# Altium schematic sheet 02 Sensors.SchDoc
size A3; CheckedBy: TBD; Engineer: Lukas Henkel; Revision: 0.2; SheetNumber: 3; SheetTotal: 3
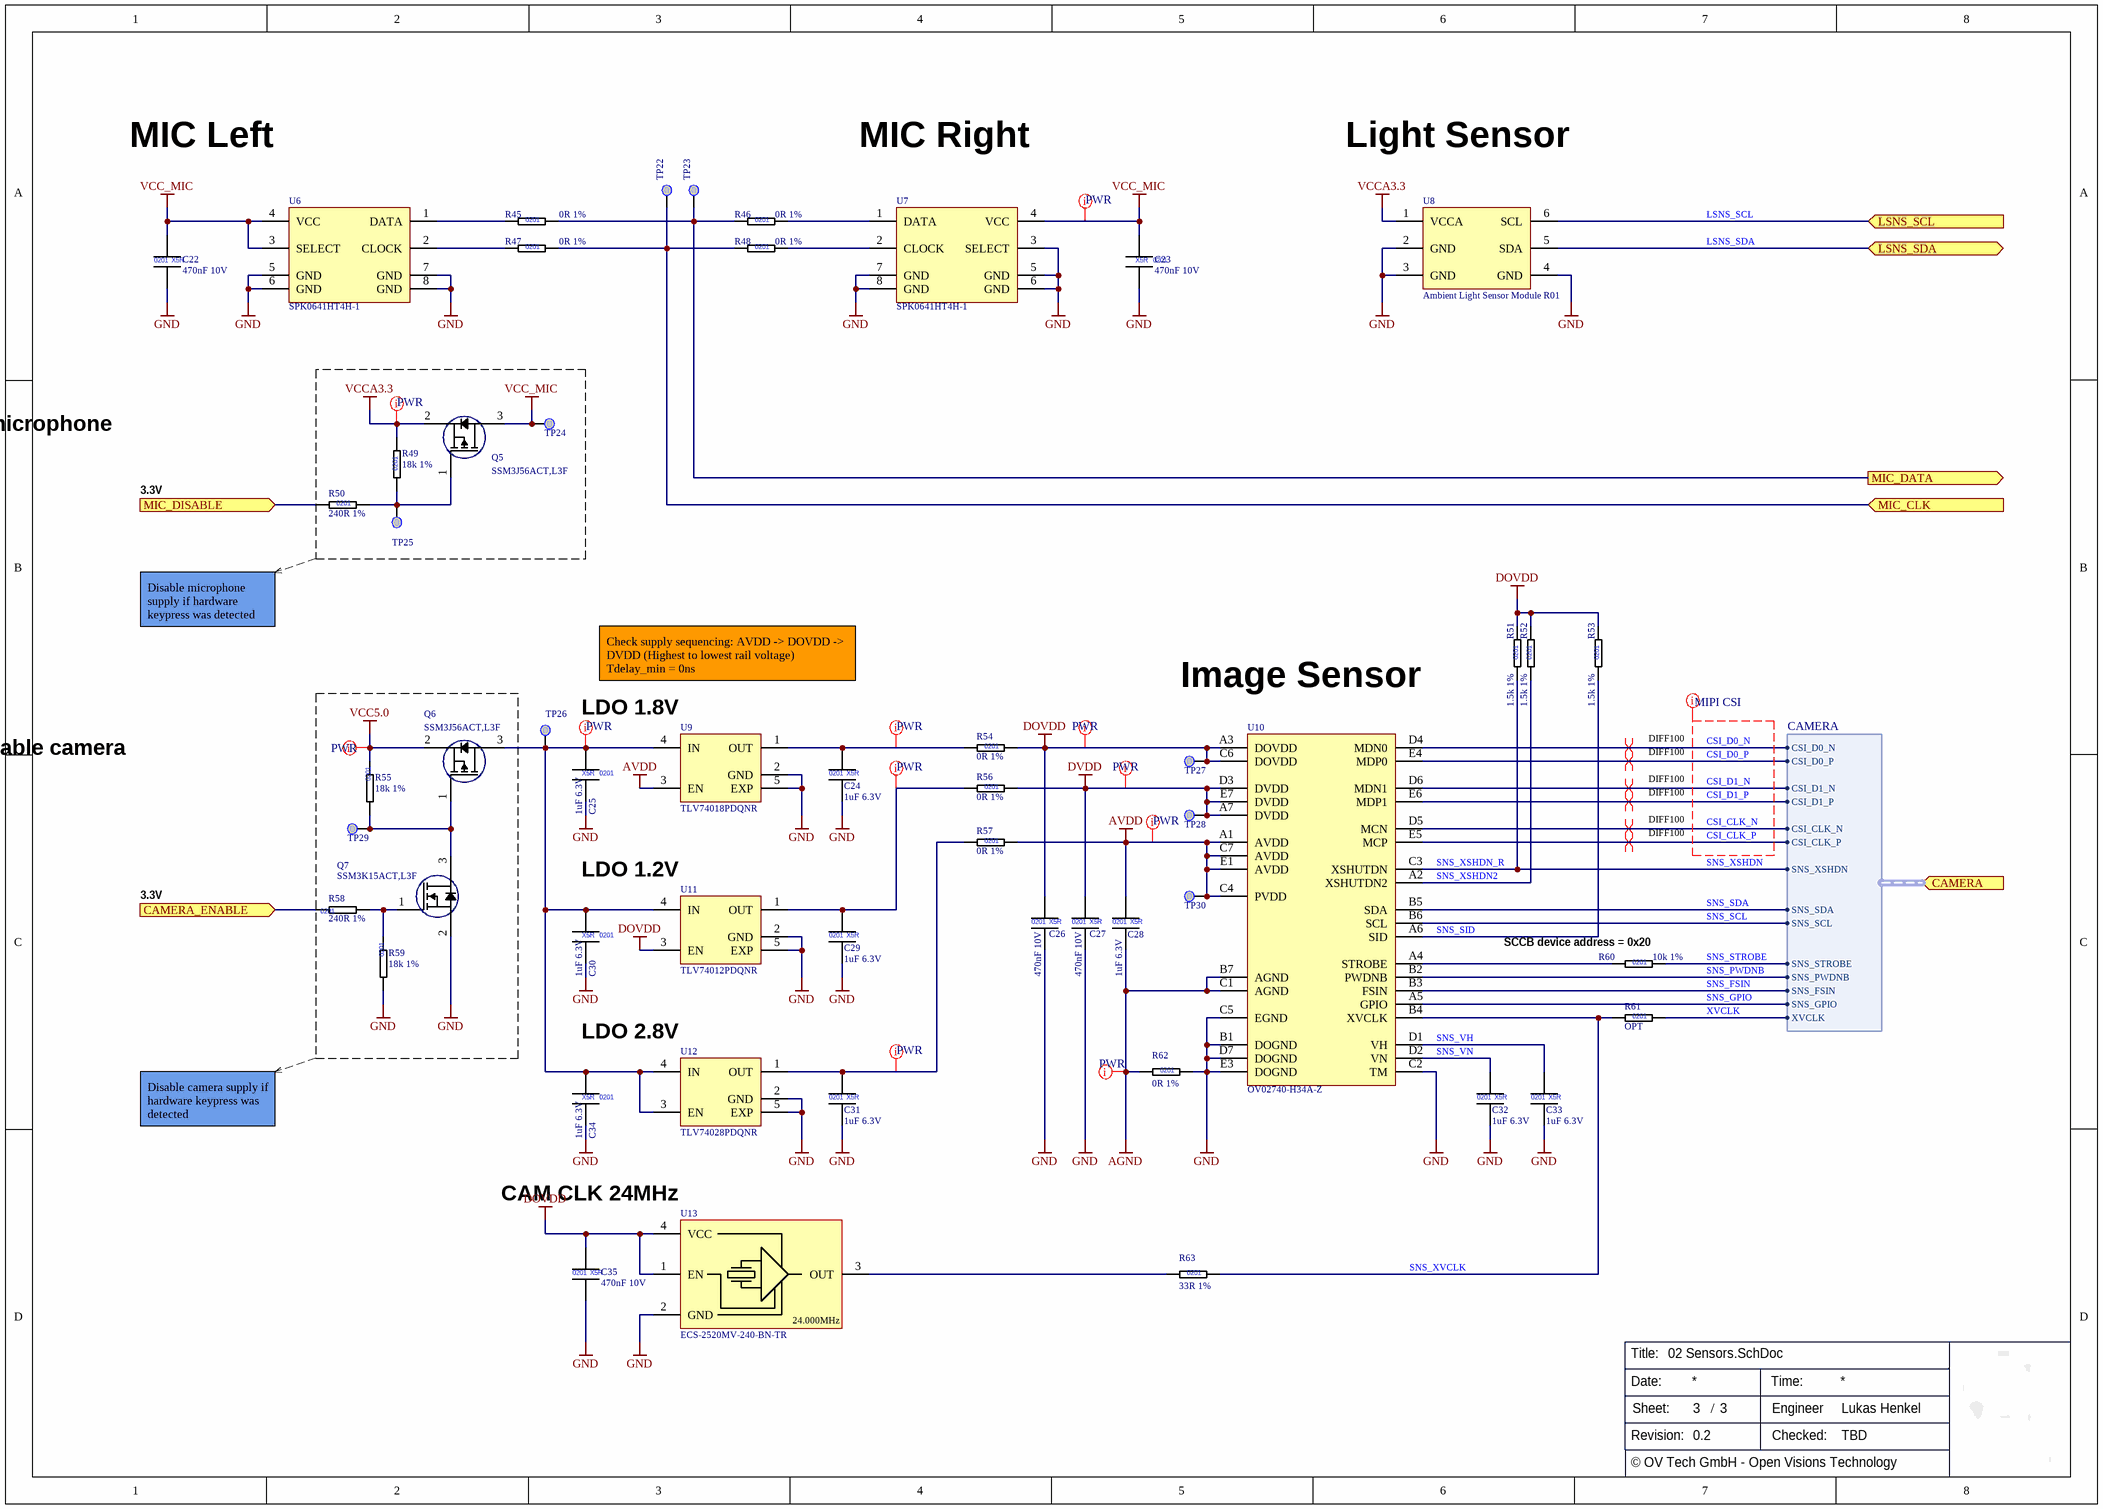
[diagram p0: 02 Sensors.SchDoc]

## Parts
C22  470nF 10V  [CAPC0603X03L]
C23  470nF 10V  [CAPC0603X03L]
C24  1uF 6.3V  [CAPC0603X03L]
C25  1uF 6.3V  [CAPC0603X03L]
C26  470nF 10V  [CAPC0603X03L]
C27  470nF 10V  [CAPC0603X03L]
C28  1uF 6.3V  [CAPC0603X03L]
C29  1uF 6.3V  [CAPC0603X03L]
C30  1uF 6.3V  [CAPC0603X03L]
C31  1uF 6.3V  [CAPC0603X03L]
C32  1uF 6.3V  [CAPC0603X03L]
C33  1uF 6.3V  [CAPC0603X03L]
C34  1uF 6.3V  [CAPC0603X03L]
C35  470nF 10V  [CAPC0603X03L]
Q5  SSM3J56ACT,L3F  [DFN65P100X50-3L]
Q6  SSM3J56ACT,L3F  [DFN65P100X50-3L]
Q7  SSM3K15ACT,L3F  [DFN65P100X50-3L]
R45  0R 1%  [RESC0603X03L]
R46  0R 1%  [RESC0603X03L]
R47  0R 1%  [RESC0603X03L]
R48  0R 1%  [RESC0603X03L]
R49  18k 1%  [RESC0603X03L]
R50  240R 1%  [RESC0603X03L]
R51  1.5k 1%  [RESC0603X03L]
R52  1.5k 1%  [RESC0603X03L]
R53  1.5k 1%  [RESC0603X03L]
R54  0R 1%  [RESC0603X03L]
R55  18k 1%  [RESC0603X03L]
R56  0R 1%  [RESC0603X03L]
R57  0R 1%  [RESC0603X03L]
R58  240R 1%  [RESC0603X03L]
R59  18k 1%  [RESC0603X03L]
R60  10k 1%  [RESC0603X03L]
R61  OPT  [RESC0603X03L]  (no BOM)
R62  0R 1%  [RESC0603X03L]
R63  33R 1%  [RESC0603X03L]
TP22  Testpoint 0.5mm  [TP_0.50mm]  (value not drawn)  (no BOM)
TP23  Testpoint 0.5mm  [TP_0.50mm]  (value not drawn)  (no BOM)
TP24  Testpoint 0.5mm  [TP_0.50mm]  (value not drawn)  (no BOM)
TP25  Testpoint 0.5mm  [TP_0.50mm]  (value not drawn)  (no BOM)
TP26  Testpoint 0.5mm  [TP_0.50mm]  (value not drawn)  (no BOM)
TP27  Testpoint 0.5mm  [TP_0.50mm]  (value not drawn)  (no BOM)
TP28  Testpoint 0.5mm  [TP_0.50mm]  (value not drawn)  (no BOM)
TP29  Testpoint 0.5mm  [TP_0.50mm]  (value not drawn)  (no BOM)
TP30  Testpoint 0.5mm  [TP_0.50mm]  (value not drawn)  (no BOM)
U6  SPK0641HT4H-1  [MIC_SPK0641HT4H-1]
U7  SPK0641HT4H-1  [MIC_SPK0641HT4H-1]
U8  Ambient Light Sensor Module R01  [ABLS-R01-ambient light sensor module]
U9  TLV74018PDQNR  [X2SON-DFN]
U10  OV02740-H34A-Z  [BGA34C53P7X5_386X292X388]
U11  TLV74012PDQNR  [X2SON-DFN]
U12  TLV74028PDQNR  [X2SON-DFN]
U13  ECS-2520MV-240-BN-TR  [Oscillator_ECS-2520MV]

## Ports
CAMERA (in, harness CAMERA), CAMERA_ENABLE (in), LSNS_SCL (in), LSNS_SDA (bidir), MIC_CLK (in), MIC_DATA (out), MIC_DISABLE (in)

## Harnesses
CAMERA: CSI_D0_N, CSI_D0_P, CSI_D1_N, CSI_D1_P, CSI_CLK_N, CSI_CLK_P, SNS_XSHDN, SNS_SDA, SNS_SCL, SNS_STROBE, SNS_PWDNB, SNS_FSIN, SNS_GPIO, XVCLK

## Nets
AGND: C28.2 R62.1 U10.B7(AGND) U10.C1(AGND)
AVDD: C28.1 R57.2 TP30.TP U9.3(EN) U10.A1(AVDD) U10.C4(PVDD) U10.C7(AVDD) U10.E1(AVDD)
DOVDD: C26.1 C35.1 R51.2 R52.2 R53.2 R54.2 TP27.TP U10.A3(DOVDD) U10.C6(DOVDD) U11.3(EN) U13.1(EN) U13.4(VCC)
DVDD: C27.1 R56.2 TP28.TP U10.A7(DVDD) U10.D3(DVDD) U10.E7(DVDD)
GND: C22.2 C23.2 C24.2 C25.2 C26.2 C27.2 C29.2 C30.2 C31.2 C32.2 C33.2 C34.2 C35.2 Q7.2(S) R59.2 R62.2 U6.5(GND) U6.6(GND) U6.7(GND) U6.8(GND) U7.3(SELECT) U7.5(GND) U7.6(GND) U7.7(GND) U7.8(GND) U8.2(GND) U8.3(GND) U8.4(GND) U9.2(GND) U9.5(EXP) U10.B1(DOGND) U10.C2(TM) U10.C5(EGND) U10.D7(DOGND) U10.E3(DOGND) U11.2(GND) U11.5(EXP) U12.2(GND) U12.5(EXP) U13.2(GND)
VCC5.0: Q6.2(S) R55.1
VCC_MIC: C22.1 C23.1 Q5.3(D) TP24.TP U6.3(SELECT) U6.4(VCC) U7.4(VCC)
VCCA3.3: Q5.2(S) R49.2 U8.1(VCCA)
CAMERA_ENABLE: R58.1 ; port CAMERA_ENABLE
CSI_CLK_N: U10.D5(MCN) ; port CAMERA.CSI_CLK_N
CSI_CLK_P: U10.E5(MCP) ; port CAMERA.CSI_CLK_P
CSI_D0_N: U10.D4(MDN0) ; port CAMERA.CSI_D0_N
CSI_D0_P: U10.E4(MDP0) ; port CAMERA.CSI_D0_P
CSI_D1_N: U10.D6(MDN1) ; port CAMERA.CSI_D1_N
CSI_D1_P: U10.E6(MDP1) ; port CAMERA.CSI_D1_P
LSNS_SCL: U8.6(SCL) ; port LSNS_SCL
LSNS_SDA: U8.5(SDA) ; port LSNS_SDA
MIC_CLK: R47.2 R48.1 TP22.TP ; port MIC_CLK
MIC_DATA: R45.2 R46.1 TP23.TP ; port MIC_DATA
MIC_DISABLE: R50.1 ; port MIC_DISABLE
SNS_FSIN: U10.B3(FSIN) ; port CAMERA.SNS_FSIN
SNS_GPIO: U10.A5(GPIO) ; port CAMERA.SNS_GPIO
SNS_PWDNB: U10.B2(PWDNB) ; port CAMERA.SNS_PWDNB
SNS_SCL: U10.B6(SCL) ; port CAMERA.SNS_SCL
SNS_SDA: U10.B5(SDA) ; port CAMERA.SNS_SDA
SNS_SID: R53.1 U10.A6(SID)
SNS_STROBE: R60.2 ; port CAMERA.SNS_STROBE
SNS_VH: C33.1 U10.D1(VH)
SNS_VN: C32.1 U10.D2(VN)
SNS_XSHDN: R51.1 U10.C3(XSHUTDN) ; port CAMERA.SNS_XSHDN  [also labelled SNS_XSHDN_R]
SNS_XSHDN2: R52.1 U10.A2(XSHUTDN2)
SNS_XVCLK: R61.1 R63.2 U10.B4(XVCLK)
XVCLK: R61.2 ; port CAMERA.XVCLK
NetC24_1: C24.1 R54.1 U9.1(OUT)
NetC25_1: C25.1 C30.1 C34.1 Q6.3(D) TP26.TP U9.4(IN) U11.4(IN) U12.3(EN) U12.4(IN)
NetC29_1: C29.1 R56.1 U11.1(OUT)
NetC31_1: C31.1 R57.1 U12.1(OUT)
NetQ5_1: Q5.1(G) R49.1 R50.2 TP25.TP
NetQ6_1: Q6.1(G) Q7.3(D) R55.2 TP29.TP
NetQ7_1: Q7.1(G) R58.2 R59.1
NetR45_1: R45.1 U6.1(DATA)
NetR46_2: R46.2 U7.1(DATA)
NetR47_1: R47.1 U6.2(CLOCK)
NetR48_2: R48.2 U7.2(CLOCK)
NetR60_1: R60.1 U10.A4(STROBE)
NetR63_1: R63.1 U13.3(OUT)

## Layout directives
differential pair; differential pair class DIFF100: CSI_CLK_N, CSI_CLK_P, CSI_D0_N, CSI_D0_P, CSI_D1_N, CSI_D1_P
net class MIPI CSI: CSI_CLK_N, CSI_CLK_P, CSI_D0_N, CSI_D0_P, CSI_D1_N, CSI_D1_P
net class PWR: AGND, AVDD, DOVDD, DVDD, NetC24_1, NetC25_1, NetC29_1, NetC31_1, VCC5.0, VCC_MIC, VCCA3.3

## Notes on the sheet
- MIC Left
- MIC Right
- Light Sensor
- Disable microphone
- 3.3V
- Disable microphone supply if hardware keypress was detected
- Image Sensor
- Check supply sequencing: AVDD -> DOVDD -> DVDD (Highest to lowest rail voltage)
  Tdelay_min = 0ns
- (near U9) LDO 1.8V
- Disable camera
- (near U11) LDO 1.2V
- (near R60) SCCB device address = 0x20
- (near U12) LDO 2.8V
- Disable camera supply if hardware keypress was detected
- (near U13) CAM CLK 24MHz
- Title:
- Date:
- Time:
- Revision:
- Sheet:
- /
- Engineer
- Checked:
- © OV Tech GmbH - Open Visions Technology
- (in symbol CAP_0201_1uF_6.3V) 0201; X5R
- (in symbol CAP_0201_470nF_10V) 0201; X5R
- (in symbol Crystal Oscillator_ECS-2520MV-240-BN-TR) 24.000MHz
- (in symbol RES_0201_0R_1%) 0201
- (in symbol RES_0201_1.5k_1%) 0201
- (in symbol RES_0201_10k_1%) 0201
- (in symbol RES_0201_18k_1%) 0201
- (in symbol RES_0201_33R_1%) 0201
- (in symbol RES_0201_240R_1%) 0201
- (in symbol RES_0201_OPT) 0201

## Library data of the parts
C22 C23 C26 C27 C35 = CAP_0201_470nF_10V: Multilayer Ceramic Capacitors MLCC - SMD/SMT 0201 10VDC; Manufacturer 1: Taiyo Yuden; Manufacturer 1 Prt. Nr.: LMK063BBJ474KPLF; Manufacturer 2 Prt. Nr.: C0603X5R1A474M030BC; Manufacturer 2: TDK
C24 C25 C28-C34 = CAP_0201_1uF_6.3V: Multilayer Ceramic Capacitors MLCC - SMD/SMT 0201 6.3VDC; Manufacturer 1: Murata Electronics; Manufacturer 1 Prt. Nr.: GRM033R60J105MEA2D; Manufacturer 2 Prt. Nr.: CL03A105MQ3CSNC; Manufacturer 2: Samsung Electro-Mechanics
Q5 Q6 = P-Channel MOSFET_SSM3J56ACT,L3F: MOSFET 20V SGL P-CH TRENCHMOS Logic Level; Manufacturer 1: Toshiba; Manufacturer 1 Prt. Nr.: SSM3J56ACT,L3F
Q7 = N-Channel MOSFET_SSM3K15ACT,L3F: MOSFET 30V SGL N-CH TRENCHMOS Logic Level; Manufacturer 1: Toshiba; Manufacturer 1 Prt. Nr.: SSM3K15ACT,L3F
R45-R48 R54 R56 R57 R62 = RES_0201_0R_1%: Thick Film Resistors - SMD 0R OHM 1%; Manufacturer 1: Yageo; Manufacturer 1 Prt. Nr.: RC0201FR-070RL; Manufacturer 2 Prt. Nr.: CRCW02010000Z0ED; Manufacturer 2: Vishay / Dale
R49 R55 R59 = RES_0201_18k_1%: Thick Film Resistors - SMD 18K OHM 1%; Manufacturer 1: Panasonic; Manufacturer 1 Prt. Nr.: ERJ-1GNF1802C; Manufacturer 2 Prt. Nr.: RK73H1HTTC1802F; Manufacturer 2: KOA Speer
R50 R58 = RES_0201_240R_1%: Thick Film Resistors - SMD 240 OHM 1%; Manufacturer 1: Yageo; Manufacturer 1 Prt. Nr.: RC0201FR-07240RL; Manufacturer 2 Prt. Nr.: CRCW0201240RFNED; Manufacturer 2: Vishay / Dale
R51-R53 = RES_0201_1.5k_1%: Thick Film Resistors - SMD 1.5K OHM 1%; Manufacturer 1: Yageo; Manufacturer 1 Prt. Nr.: RC0201FR-071K5L; Manufacturer 2 Prt. Nr.: CRCW02011K50FNED; Manufacturer 2: Vishay / Dale
R60 = RES_0201_10k_1%: Thick Film Resistors - SMD 10K OHM 1%; Manufacturer 1: Yageo; Manufacturer 1 Prt. Nr.: RC0201FR-0710KL; Manufacturer 2 Prt. Nr.: CRCW020110K0FNED; Manufacturer 2: Vishay / Dale
R61 = RES_0201_OPT: Thick Film Resistors - SMD Optinal
R63 = RES_0201_33R_1%: Thick Film Resistors - SMD 33R OHM 1%; Manufacturer 1: Yageo; Manufacturer 1 Prt. Nr.: RC0201FR-0733RL; Manufacturer 2 Prt. Nr.: CRCW020133R0FNED; Manufacturer 2: Vishay / Dale
U6 U7 = Digital Microphone PDM_SPK0641HT4H-1: Digital MEMS Microphone Top Port PDM SPK0641HT4H-1; Manufacturer 1: Knowles; Manufacturer 1 Prt. Nr.: SPK0641HT4H-1
U8 = Light Sensor Module R01: Custom Ambient Light Sensor Module with LGA Footprint
U9 = LDO 1.8V_TLV74018PDQNR: LDO voltage regulator 300mA X2SON; Manufacturer 1: Texas Instruments; Manufacturer 1 Prt. Nr.: TLV74018PDQNR
U10 = Image Sensor_OV2740: MIPI CSI Image Sensor 1080p 1/6"; Manufacturer 1 Prt. Nr.: OmniVision; Manufacturer 1: OV02740-H34A-Z
U11 = LDO 1.2V_TLV74012PDQNR: LDO voltage regulator 300mA X2SON; Manufacturer 1: Texas Instruments; Manufacturer 1 Prt. Nr.: TLV74012PDQNR
U12 = LDO 2.8V_TLV74028PDQNR: LDO voltage regulator 300mA X2SON; Manufacturer 1: Texas Instruments; Manufacturer 1 Prt. Nr.: TLV74028PDQNR
U13 = Crystal Oscillator_ECS-2520MV-240-BN-TR: Crystal Oscillator 2520 miniature SMD package; Manufacturer 1: ECS; Manufacturer 1 Prt. Nr.: ECS-2520MV-240-BN-TR